# Altium schematic sheet FPGA1_POWER.SchDoc
size A4
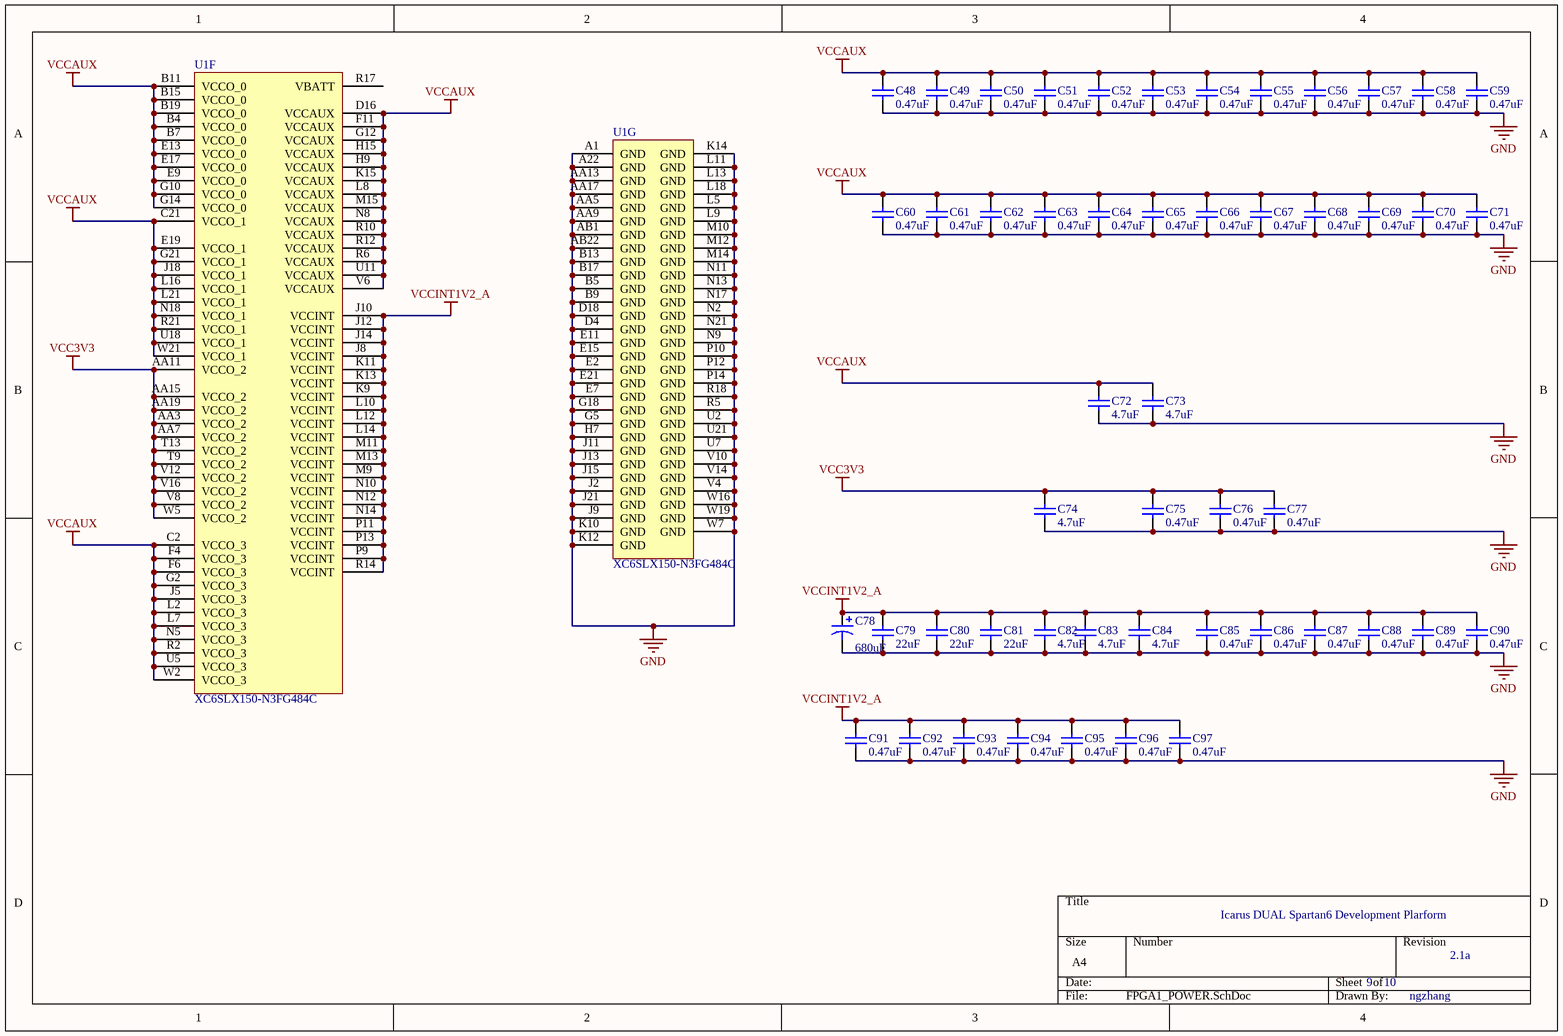
[diagram p0: FPGA1_POWER.SchDoc]

## Parts
C48  0.47uF  [0402]
C49  0.47uF  [0402]
C50  0.47uF  [0402]
C51  0.47uF  [0402]
C52  0.47uF  [0402]
C53  0.47uF  [0402]
C54  0.47uF  [0402]
C55  0.47uF  [0402]
C56  0.47uF  [0402]
C57  0.47uF  [0402]
C58  0.47uF  [0402]
C59  0.47uF  [0402]
C60  0.47uF  [0402]
C61  0.47uF  [0402]
C62  0.47uF  [0402]
C63  0.47uF  [0402]
C64  0.47uF  [0402]
C65  0.47uF  [0402]
C66  0.47uF  [0402]
C67  0.47uF  [0402]
C68  0.47uF  [0402]
C69  0.47uF  [0402]
C70  0.47uF  [0402]
C71  0.47uF  [0402]
C72  4.7uF  [C0805]
C73  4.7uF  [C0805]
C74  4.7uF  [C0805]
C75  0.47uF  [0402]
C76  0.47uF  [0402]
C77  0.47uF  [0402]
C78  680uF  [D]
C79  22uF  [C1206]
C80  22uF  [C1206]
C81  22uF  [C1206]
C82  4.7uF  [C0805]
C83  4.7uF  [C0805]
C84  4.7uF  [C0805]
C85  0.47uF  [0402]
C86  0.47uF  [0402]
C87  0.47uF  [0402]
C88  0.47uF  [0402]
C89  0.47uF  [0402]
C90  0.47uF  [0402]
C91  0.47uF  [0402]
C92  0.47uF  [0402]
C93  0.47uF  [0402]
C94  0.47uF  [0402]
C95  0.47uF  [0402]
C96  0.47uF  [0402]
C97  0.47uF  [0402]
U1  XC6SLX150-N3FG484C  [FG484]  (parts F,G of 7)

## Nets
GND: C48.1 C49.1 C50.1 C51.1 C52.1 C53.1 C54.1 C55.1 C56.1 C57.1 C58.1 C59.1 C60.1 C61.1 C62.1 C63.1 C64.1 C65.1 C66.1 C67.1 C68.1 C69.1 C70.1 C71.1 C72.1 C73.1 C74.1 C75.1 C76.1 C77.1 C78.2 C79.1 C80.1 C81.1 C82.1 C83.1 C84.1 C85.1 C86.1 C87.1 C88.1 C89.1 C90.1 C91.1 C92.1 C93.1 C94.1 C95.1 C96.1 C97.1 U1.A1(GND) U1.A22(GND) U1.AA5(GND) U1.AA9(GND) U1.AA13(GND) U1.AA17(GND) U1.AB1(GND) U1.AB22(GND) U1.B5(GND) U1.B9(GND) U1.B13(GND) U1.B17(GND) U1.D4(GND) U1.D18(GND) U1.E2(GND) U1.E7(GND) U1.E11(GND) U1.E15(GND) U1.E21(GND) U1.G5(GND) U1.G18(GND) U1.H7(GND) U1.J2(GND) U1.J9(GND) U1.J11(GND) U1.J13(GND) U1.J15(GND) U1.J21(GND) U1.K10(GND) U1.K12(GND) U1.K14(GND) U1.L5(GND) U1.L9(GND) U1.L11(GND) U1.L13(GND) U1.L18(GND) U1.M10(GND) U1.M12(GND) U1.M14(GND) U1.N2(GND) U1.N9(GND) U1.N11(GND) U1.N13(GND) U1.N17(GND) U1.N21(GND) U1.P10(GND) U1.P12(GND) U1.P14(GND) U1.R5(GND) U1.R18(GND) U1.U2(GND) U1.U7(GND) U1.U21(GND) U1.V4(GND) U1.V10(GND) U1.V14(GND) U1.W7(GND) U1.W16(GND) U1.W19(GND)
VCC3V3: C74.2 C75.2 C76.2 C77.2 U1.AA3(VCCO_2) U1.AA7(VCCO_2) U1.AA11(VCCO_2) U1.AA15(VCCO_2) U1.AA19(VCCO_2) U1.T9(VCCO_2) U1.T13(VCCO_2) U1.V8(VCCO_2) U1.V12(VCCO_2) U1.V16(VCCO_2) U1.W5(VCCO_2)
VCCAUX: C48.2 C49.2 C50.2 C51.2 C52.2 C53.2 C54.2 C55.2 C56.2 C57.2 C58.2 C59.2 C60.2 C61.2 C62.2 C63.2 C64.2 C65.2 C66.2 C67.2 C68.2 C69.2 C70.2 C71.2 C72.2 C73.2 U1.B4(VCCO_0) U1.B7(VCCO_0) U1.B11(VCCO_0) U1.B15(VCCO_0) U1.B19(VCCO_0) U1.C2(VCCO_3) U1.C21(VCCO_1) U1.D16(VCCAUX) U1.E9(VCCO_0) U1.E13(VCCO_0) U1.E17(VCCO_0) U1.E19(VCCO_1) U1.F4(VCCO_3) U1.F6(VCCO_3) U1.F11(VCCAUX) U1.G2(VCCO_3) U1.G10(VCCO_0) U1.G12(VCCAUX) U1.G14(VCCO_0) U1.G21(VCCO_1) U1.H9(VCCAUX) U1.H15(VCCAUX) U1.J5(VCCO_3) U1.J18(VCCO_1) U1.K15(VCCAUX) U1.L2(VCCO_3) U1.L7(VCCO_3) U1.L8(VCCAUX) U1.L16(VCCO_1) U1.L21(VCCO_1) U1.M15(VCCAUX) U1.N5(VCCO_3) U1.N8(VCCAUX) U1.N18(VCCO_1) U1.R2(VCCO_3) U1.R6(VCCAUX) U1.R10(VCCAUX) U1.R12(VCCAUX) U1.R21(VCCO_1) U1.U5(VCCO_3) U1.U11(VCCAUX) U1.U18(VCCO_1) U1.V6(VCCAUX) U1.W2(VCCO_3) U1.W21(VCCO_1)
VCCINT1V2_A: C78.1 C79.2 C80.2 C81.2 C82.2 C83.2 C84.2 C85.2 C86.2 C87.2 C88.2 C89.2 C90.2 C91.2 C92.2 C93.2 C94.2 C95.2 C96.2 C97.2 U1.J8(VCCINT) U1.J10(VCCINT) U1.J12(VCCINT) U1.J14(VCCINT) U1.K9(VCCINT) U1.K11(VCCINT) U1.K13(VCCINT) U1.L10(VCCINT) U1.L12(VCCINT) U1.L14(VCCINT) U1.M9(VCCINT) U1.M11(VCCINT) U1.M13(VCCINT) U1.N10(VCCINT) U1.N12(VCCINT) U1.N14(VCCINT) U1.P9(VCCINT) U1.P11(VCCINT) U1.P13(VCCINT) U1.R14(VCCINT)

Not connected (* = marked no-connect by the designer): U1 R17(VBATT)

## Notes on the sheet
- Icarus DUAL Spartan6 Development Plarform
- 9
- 10
- 2.1a
- ngzhang

## Library data of the parts
C48-C77 C79-C97 = Cap Semi: Capacitor (Semiconductor SIM Model); Published: 8-Jun-2000; LatestRevisionDate: 29-May-2009; LatestRevisionNote: IPC-7351 Footprint Added.; PackageReference: C1206; Publisher: Altium Limited; PackageDescription: Chip Capacitor
  C48-C71 C75-C77 C85-C97: Value: 0.47uF
  C72-C74 C82-C84: Value: 4.7uF
  C79-C81: Value: 22uF
C78 = Cap Pol3: Polarized Capacitor (Surface Mount); Published: 8-Jun-2000; LatestRevisionDate: 29-May-2009; LatestRevisionNote: IPC-7351 Footprint Added.; PackageReference: C0805; Publisher: Altium Limited; PackageDescription: Chip Capacitor; Value: 680uF
U1 = XC6SLX150-N3FG484C: Spartan-6 LX 1.2V FPGA, 338 User I/Os, 484-Ball Fine-Pitch BGA (1.0mm Pitch), Speed Grade 3N, Commercial Grade; Published: 24-Aug-2010; DatasheetVersion: ver1.6, Nov-2010; PackageVersion: ver1.1, Dec-2008; PackageReference: FG484; Publisher: Altium Limited; PackageDescription: 484-Ball Fine Pitch Ball Grid Array 1.00 mm Pitch (FG484); Code_JEDEC: MS-034-AAJ-1; Code_IPC: BGA100P22X22-484; ComponentLink1Description: Manufacturer Link; ComponentLink1URL: http://www.xilinx.com; ComponentLink2Description: Spartan-6 Datasheet; ComponentLink2URL: http://www.xilinx.com/support/documentation/data_sheets/ds160.pdf; ComponentLink3Description: Spartan-6 Documents; ComponentLink3URL: http://www.xilinx.com/support/documentation/spartan-6.htm; ComponentLink4Description: Xilinx.com Home; ComponentLink4URL: http://www.xilinx.com